# Altium project Arrow-ESC.PrjPcb
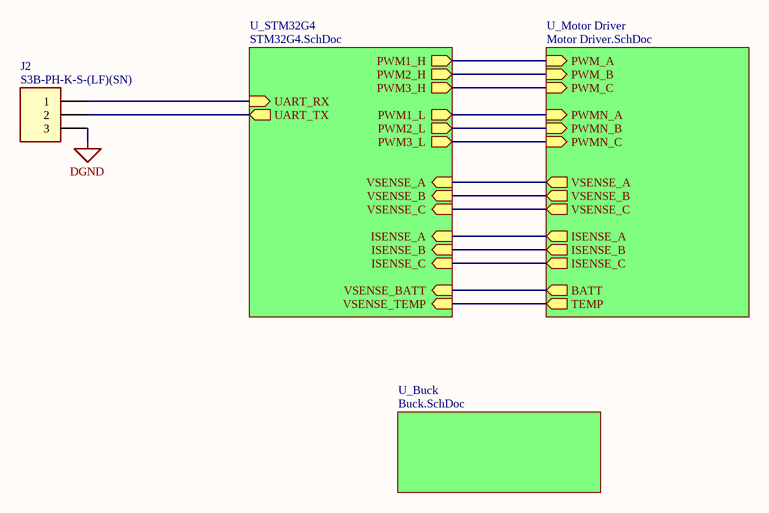
[diagram p0: Top Level.SchDoc]
5 sheets, 87 parts. Net scope: hierarchical (ports join the sheet entries above them; power ports are global).
Board file: Arrow-ESC.PcbDoc
Sheets:
  Top Level.SchDoc
    U_Motor Driver = Motor Driver.SchDoc
      U_Motor Phase = Motor Phase.SchDoc
      U_Motor Phase = Motor Phase.SchDoc
      U_Motor Phase = Motor Phase.SchDoc
    U_STM32G4 = STM32G4.SchDoc
    U_Buck = Buck.SchDoc

## Sheet Top Level.SchDoc
size A; SheetNumber: 1; SheetTotal: 5

### Parts
J2  S3B-PH-K-S-(LF)(SN)  [CONN-TH_3P-P2.00_S3B-PH-K-S-LF-SN]

### Sub-sheets
U_Buck = Buck.SchDoc: no entries
U_Motor Driver = Motor Driver.SchDoc: ISENSE_A (out), ISENSE_B (out), ISENSE_C (out), VSENSE_A (out), VSENSE_B (out), VSENSE_C (out), PWM_A (in), PWM_B (in), PWM_C (in), PWMN_A (in), PWMN_B (in), PWMN_C (in), BATT (out), TEMP (out)
U_STM32G4 = STM32G4.SchDoc: PWM1_H (out), PWM1_L (out), PWM2_H (out), PWM2_L (out), PWM3_H (out), PWM3_L (out), ISENSE_A (in), ISENSE_B (in), ISENSE_C (in), VSENSE_A (in), VSENSE_B (in), VSENSE_C (in), VSENSE_BATT (in), VSENSE_TEMP (in), UART_TX (out), UART_RX (in)

### Nets
DGND: J2.3
ADC1_IN1: sheet U_Motor Driver/VSENSE_A, sheet U_STM32G4/VSENSE_A
ADC1_IN2: sheet U_Motor Driver/VSENSE_B, sheet U_STM32G4/VSENSE_B
ADC1_IN5: sheet U_Motor Driver/VSENSE_C, sheet U_STM32G4/VSENSE_C
ADC1_IN10: sheet U_Motor Driver/BATT, sheet U_STM32G4/VSENSE_BATT
ADC1_IN11: sheet U_Motor Driver/TEMP, sheet U_STM32G4/VSENSE_TEMP
OPAMP1_VINP: sheet U_Motor Driver/ISENSE_A, sheet U_STM32G4/ISENSE_A
OPAMP2_VINP: sheet U_Motor Driver/ISENSE_B, sheet U_STM32G4/ISENSE_B
OPAMP3_VINP: sheet U_Motor Driver/ISENSE_C, sheet U_STM32G4/ISENSE_C
TIM1_CH1: sheet U_Motor Driver/PWM_A, sheet U_STM32G4/PWM1_H
TIM1_CH1N: sheet U_Motor Driver/PWMN_A, sheet U_STM32G4/PWM1_L
TIM1_CH2: sheet U_Motor Driver/PWM_B, sheet U_STM32G4/PWM2_H
TIM1_CH2N: sheet U_Motor Driver/PWMN_B, sheet U_STM32G4/PWM2_L
TIM1_CH3: sheet U_Motor Driver/PWM_C, sheet U_STM32G4/PWM3_H
TIM1_CH3N: sheet U_Motor Driver/PWMN_C, sheet U_STM32G4/PWM3_L
USART3_RX: J2.1 ; sheet U_STM32G4/UART_RX
USART3_TX: J2.2 ; sheet U_STM32G4/UART_TX

### Library data of the parts
J2 = S3B-PH-K-S-(LF)(SN): 3P 1x3P PH Tin -25℃~+85℃ White 2mm 100V 3 2A 1 Right Angle Through Hole,Right Angle,P=2mm Headers, Male Pins RoHS; Manu Part #: S3B-PH-K-S-(LF)(SN); LCSC Part #: C157929

## Sheet Motor Driver.SchDoc
size A; SheetNumber: 3; SheetTotal: 5
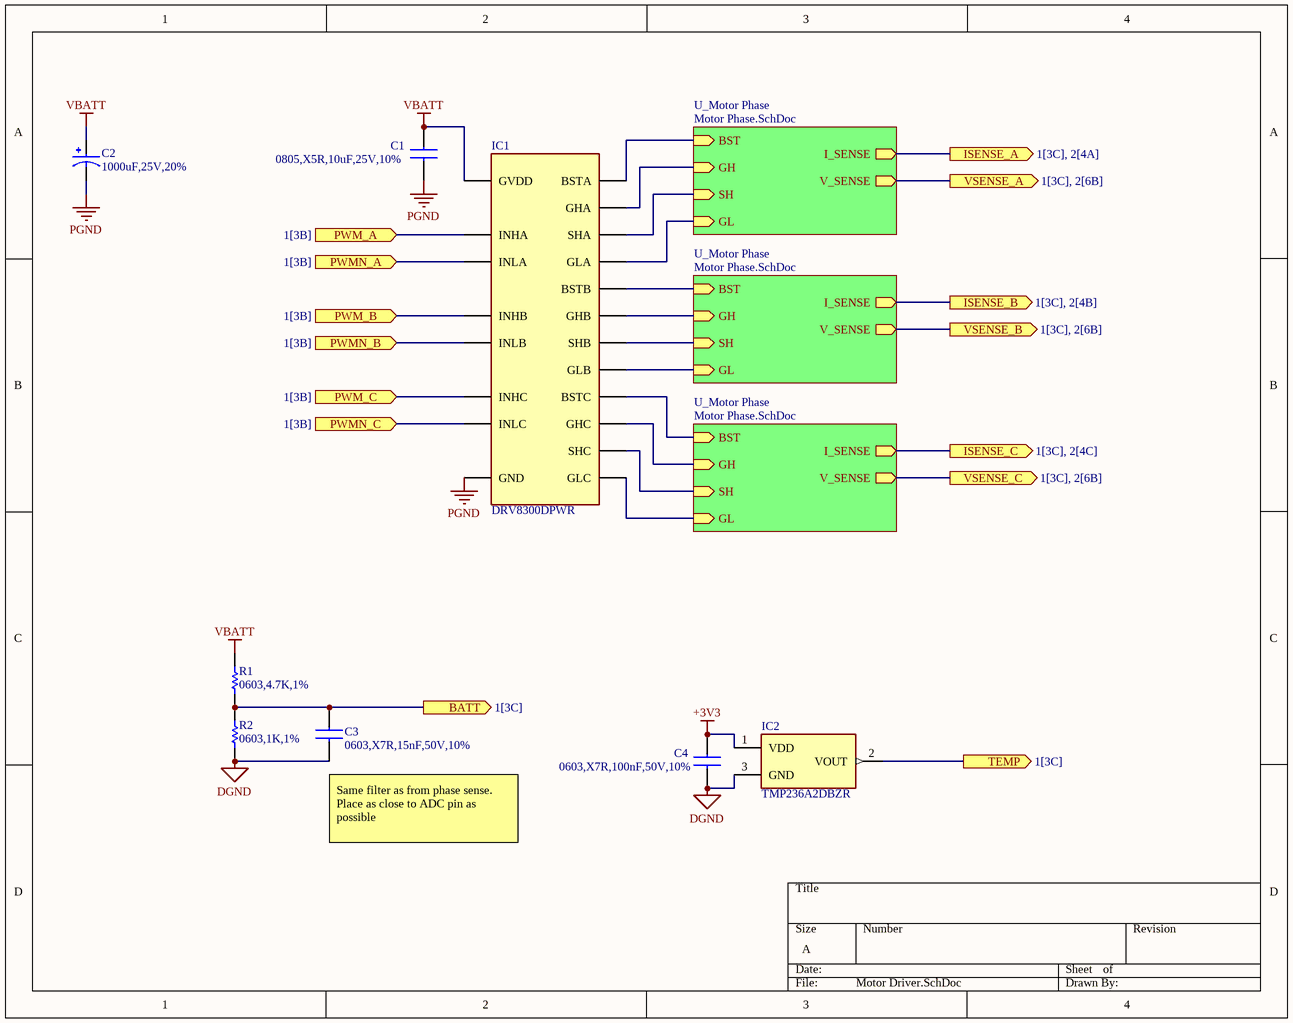
[diagram p1: Motor Driver.SchDoc]

### Parts
C1  0805,X5R,10uF,25V,10%  [CAPC2012X145N]
C2  1000uF,25V,20%  [CAP-TH_BD10.0-P5.00-D1.0-FD]
C3  0603,X7R,15nF,50V,10%  [CAPC1608X90N]
C4  0603,X7R,100nF,50V,10%  [CAPC1608X90N]
IC1  DRV8300DPWR  [SOP65P640X120-20N]
IC2  TMP236A2DBZR  [SOT95P237X112-3N]
R1  0603,4.7K,1%  [RESC1608X55N]
R2  0603,1K,1%  [RESC1608X55N]

### Sub-sheets
U_Motor Phase = Motor Phase.SchDoc: I_SENSE (out), V_SENSE (out), GH (in), BST (in), SH (in), GL (in)
U_Motor Phase = Motor Phase.SchDoc: I_SENSE (out), V_SENSE (out), GH (in), BST (in), SH (in), GL (in)
U_Motor Phase = Motor Phase.SchDoc: I_SENSE (out), V_SENSE (out), GH (in), BST (in), SH (in), GL (in)

### Ports
BATT (out, see 1[3C]), ISENSE_A (out, see 1[3C], 2[4A]), ISENSE_B (out, see 1[3C], 2[4B]), ISENSE_C (out, see 1[3C], 2[4C]), PWM_A (in, see 1[3B]), PWM_B (in, see 1[3B]), PWM_C (in, see 1[3B]), PWMN_A (in, see 1[3B]), PWMN_B (in, see 1[3B]), PWMN_C (in, see 1[3B]), TEMP (out, see 1[3C]), VSENSE_A (out, see 1[3C], 2[6B]), VSENSE_B (out, see 1[3C], 2[6B]), VSENSE_C (out, see 1[3C], 2[6B])

### Nets
+3V3: C4.2 IC2.1(VDD)
DGND: C3.1 C4.1 IC2.3(GND) R2.1
PGND: C1.2 C2.2 IC1.8(GND)
VBATT: C1.1 C2.1 IC1.7(GVDD) R1.2
ADC1_IN1: port VSENSE_A, sheet U_Motor Phase/V_SENSE
ADC1_IN2: port VSENSE_B, sheet U_Motor Phase/V_SENSE
ADC1_IN5: port VSENSE_C, sheet U_Motor Phase/V_SENSE
ADC1_IN10: C3.2 R1.1 R2.2 ; port BATT
ADC1_IN11: IC2.2(VOUT) ; port TEMP
OPAMP1_VINP: port ISENSE_A, sheet U_Motor Phase/I_SENSE
OPAMP2_VINP: port ISENSE_B, sheet U_Motor Phase/I_SENSE
OPAMP3_VINP: port ISENSE_C, sheet U_Motor Phase/I_SENSE
TIM1_CH1: IC1.1(INHA) ; port PWM_A
TIM1_CH1N: IC1.4(INLA) ; port PWMN_A
TIM1_CH2: IC1.2(INHB) ; port PWM_B
TIM1_CH2N: IC1.5(INLB) ; port PWMN_B
TIM1_CH3: IC1.3(INHC) ; port PWM_C
TIM1_CH3N: IC1.6(INLC) ; port PWMN_C
NetC5_1_1: IC1.12(SHC) ; sheet U_Motor Phase/SH
NetC5_1_2: IC1.14(BSTC) ; sheet U_Motor Phase/BST
NetC5_2_1: IC1.15(SHB) ; sheet U_Motor Phase/SH
NetC5_2_2: IC1.17(BSTB) ; sheet U_Motor Phase/BST
NetC5_3_1: IC1.18(SHA) ; sheet U_Motor Phase/SH
NetC5_3_2: IC1.20(BSTA) ; sheet U_Motor Phase/BST
NetIC1_9: IC1.9(GLC) ; sheet U_Motor Phase/GL
NetIC1_10: IC1.10(GLB) ; sheet U_Motor Phase/GL
NetIC1_11: IC1.11(GLA) ; sheet U_Motor Phase/GL
NetIC1_13: IC1.13(GHC) ; sheet U_Motor Phase/GH
NetIC1_16: IC1.16(GHB) ; sheet U_Motor Phase/GH
NetIC1_19: IC1.19(GHA) ; sheet U_Motor Phase/GH

### Notes on the sheet
- (near C3) Same filter as from phase sense.
  Place as close to ADC pin as possible

### Library data of the parts
C1 = CC0805KKX5R8BB106: 10 µF ±10% 25V Ceramic Capacitor X5R 0805 (2012 Metric); Manufacturer_Name: YAGEO; Datasheet Link: https://www.yageo.com/upload/media/product/productsearch/datasheet/mlcc/UPY-GPHC_X5R_4V-to-50V_27.pdf; Height: 1.45mm; Manufacturer_Part_Number: CC0805KKX5R8BB106; Mouser Part Number: 603-CC805KKX5R8BB106; Mouser Price/Stock: https://www.mouser.co.uk/ProductDetail/YAGEO/CC0805KKX5R8BB106?qs=57cj7OiSijm89pM64t1AGQ%3D%3D; Arrow Part Number: CC0805KKX5R8BB106; Arrow Price/Stock: https://www.arrow.com/en/products/cc0805kkx5r8bb106/yageo?utm_currency=USD&region=nac; LCSC Part #: C89831
C2 = 25PK1000MEFC10*16: 1000uF 25V ±20% 870mA@120Hz Through Hole,D10xL16mm Aluminum Electrolytic Capacitors - Leaded ROHS; LCSC Part #: C109451
C3 = CC0603KRX7R9BB153: 50V 15nF X7R ±10% 0603 Multilayer Ceramic Capacitors MLCC - SMD/SMT ROHS; Manufacturer_Name: YAGEO; Datasheet Link: https://componentsearchengine.com/Datasheets/2/CC0603KRX7R9BB104.pdf; Height: 0.9mm; Manufacturer_Part_Number: CC0603KRX7R9BB153; Mouser Part Number: 603-CC603KRX7R9BB104; Mouser Price/Stock: https://www.mouser.co.uk/ProductDetail/YAGEO/CC0603KRX7R9BB104?qs=vTakOoo5QyLvVCYM2ge8LQ%3D%3D; Arrow Part Number: CC0603KRX7R9BB104; Arrow Price/Stock: https://www.arrow.com/en/products/cc0603krx7r9bb104/yageo?utm_currency=USD&region=europe; LCSC Part #: C107076
C4 = CC0603KRX7R9BB104: 50V 100nF X7R ±10% 0603 Multilayer Ceramic Capacitors MLCC - SMD/SMT ROHS; Manufacturer_Name: YAGEO; Datasheet Link: https://componentsearchengine.com/Datasheets/2/CC0603KRX7R9BB104.pdf; Height: 0.9mm; Manufacturer_Part_Number: CC0603KRX7R9BB104; Mouser Part Number: 603-CC603KRX7R9BB104; Mouser Price/Stock: https://www.mouser.co.uk/ProductDetail/YAGEO/CC0603KRX7R9BB104?qs=vTakOoo5QyLvVCYM2ge8LQ%3D%3D; Arrow Part Number: CC0603KRX7R9BB104; Arrow Price/Stock: https://www.arrow.com/en/products/cc0603krx7r9bb104/yageo?utm_currency=USD&region=europe; LCSC Part #: C14663
IC1 = DRV8300DPWR: TSSOP-20 Brushless DC (BLDC) Motor Driver ROHS; Manufacturer_Name: Texas Instruments; Height: 1.2mm; Manufacturer_Part_Number: DRV8300DPWR; Mouser Part Number: 595-DRV8300DPWR; Mouser Price/Stock: https://www.mouser.co.uk/ProductDetail/Texas-Instruments/DRV8300DPWR?qs=eP2BKZSCXI6qJbKdYnGwBg%3D%3D; Arrow Part Number: DRV8300DPWR; Arrow Price/Stock: https://www.arrow.com/en/products/drv8300dpwr/texas-instruments?utm_currency=USD&region=nac; LCSC Part #: C3036056
IC2 = TMP236A2DBZR: Low-power and high-precision analog output temperature sensor; Manufacturer_Name: Texas Instruments; Datasheet Link: http://www.ti.com/lit/gpn/tmp236; Height: 1.12mm; Manufacturer_Part_Number: TMP236A2DBZR; Mouser Part Number: 595-TMP236A2DBZR; Mouser Price/Stock: https://www.mouser.co.uk/ProductDetail/Texas-Instruments/TMP236A2DBZR?qs=lc2O%252BfHJPVanftlPgPUvow%3D%3D; Arrow Part Number: TMP236A2DBZR; Arrow Price/Stock: https://www.arrow.com/en/products/tmp236a2dbzr/texas-instruments?region=nac; LCSC Part #: C2859666
R1 = RC0603FR-074K7L: 100mW Thick Film Resistor 75V ±100ppm/℃ ±1% 4.7kΩ 0603 Chip Resistor - Surface Mount ROHS; Manufacturer_Name: YAGEO; Datasheet Link: https://www.mouser.com/catalog/specsheets/YAGEO_PYu_RC_Group_51_RoHS_L_12.pdf; Height: 0.55mm; Manufacturer_Part_Number: RC0603FR-074K7L; LCSC Part #: C99782
R2 = RC0603FR-071KL: 100mW Thick Film Resistor 75V ±100ppm/℃ ±1% 1kΩ 0603 Chip Resistor - Surface Mount ROHS; Manufacturer_Name: YAGEO; Datasheet Link: https://www.mouser.com/catalog/specsheets/YAGEO_PYu_RC_Group_51_RoHS_L_12.pdf; Height: 0.55mm; Manufacturer_Part_Number: RC0603FR-071KL; LCSC Part #: C22548

## Sheet Motor Phase.SchDoc
size A; SheetNumber: 4; SheetTotal: 5
Used 3 times, as channels U_Motor Driver/U_Motor Phase, U_Motor Driver/U_Motor Phase, U_Motor Driver/U_Motor Phase. Parts and nets are listed once, with the designators drawn on the sheet.
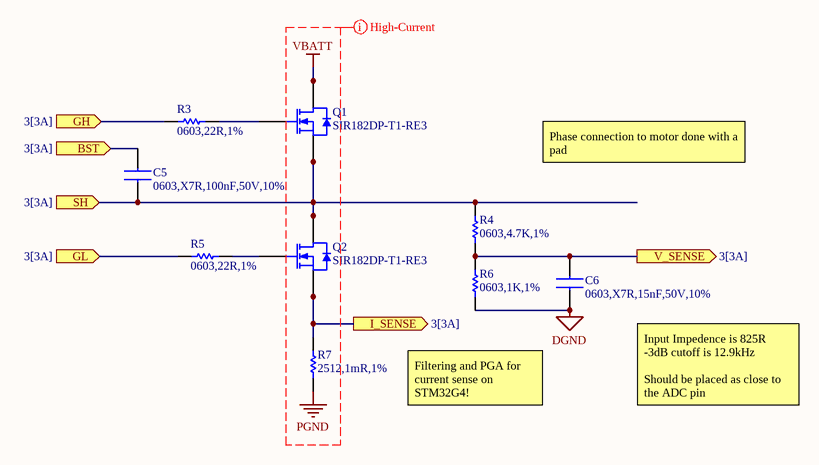
[diagram p2: Motor Phase.SchDoc]

### Parts
C5  0603,X7R,100nF,50V,10%  [CAPC1608X90N]
C6  0603,X7R,15nF,50V,10%  [CAPC1608X90N]
Q1  SIR182DP-T1-RE3  [POWERPAK-SO-8_L5.9-W4.9-P1.27-LS6.2-BL]
Q2  SIR182DP-T1-RE3  [POWERPAK-SO-8_L5.9-W4.9-P1.27-LS6.2-BL]
R3  0603,22R,1%  [RESC1608X55N]
R4  0603,4.7K,1%  [RESC1608X55N]
R5  0603,22R,1%  [RESC1608X55N]
R6  0603,1K,1%  [RESC1608X55N]
R7  2512,1mR,1%  [RES-SMD_L6.4-W3.2_RLP25]

### Ports
BST (in, see 3[3A]), GH (in, see 3[3A]), GL (in, see 3[3A]), I_SENSE (out, see 3[3A]), SH (in, see 3[3A]), V_SENSE (out, see 3[3A])

### Nets
DGND: C6.1 R6.1
PGND: R7.1
VBATT: Q1.5(D) Q1.6(D) Q1.7(D) Q1.8(D)
BST: C5.2 ; port BST
GH: R3.1 ; port GH
GL: R5.1 ; port GL
I_SENSE: Q2.1(S) Q2.2(S) Q2.3(S) R7.2 ; port I_SENSE
SH: C5.1 Q1.1(S) Q1.2(S) Q1.3(S) Q2.5(D) Q2.6(D) Q2.7(D) Q2.8(D) R4.2 ; port SH
V_SENSE: C6.2 R4.1 R6.2 ; port V_SENSE
NetQ1_4: Q1.4(G) R3.2
NetQ2_4: Q2.4(G) R5.2

### Channels
U_Motor Driver/U_Motor Phase: designators end in _3; ports BST=NetC5_3_2 GH=NetIC1_19 GL=NetIC1_11 I_SENSE=OPAMP1_VINP SH=NetC5_3_1 V_SENSE=ADC1_IN1
U_Motor Driver/U_Motor Phase: designators end in _2; ports BST=NetC5_2_2 GH=NetIC1_16 GL=NetIC1_10 I_SENSE=OPAMP2_VINP SH=NetC5_2_1 V_SENSE=ADC1_IN2
U_Motor Driver/U_Motor Phase: designators end in _1; ports BST=NetC5_1_2 GH=NetIC1_13 GL=NetIC1_9 I_SENSE=OPAMP3_VINP SH=NetC5_1_1 V_SENSE=ADC1_IN5

### Layout directives
net class High-Current: PGND, VBATT

### Notes on the sheet
- Phase connection to motor done with a pad
- Filtering and PGA for current sense on STM32G4!
- Input Impedence is 825R
  -3dB cutoff is 12.9kHz
  Should be placed as close to the ADC pin

### Library data of the parts
C5 = CC0603KRX7R9BB104: as C4 on sheet Motor Driver; Datasheet Link: https://componentsearchengine.com/Datasheets/2/CC0603KRX7R9BB104.pdf; Height: 0.9mm; Manufacturer_Part_Number: CC0603KRX7R9BB104; Mouser Part Number: 603-CC603KRX7R9BB104; Mouser Price/Stock: https://www.mouser.co.uk/ProductDetail/YAGEO/CC0603KRX7R9BB104?qs=vTakOoo5QyLvVCYM2ge8LQ%3D%3D; Arrow Part Number: CC0603KRX7R9BB104; Arrow Price/Stock: https://www.arrow.com/en/products/cc0603krx7r9bb104/yageo?utm_currency=USD&region=europe; LCSC Part #: C14663
C6 = CC0603KRX7R9BB153: as C3 on sheet Motor Driver; Datasheet Link: https://componentsearchengine.com/Datasheets/2/CC0603KRX7R9BB104.pdf; Height: 0.9mm; Manufacturer_Part_Number: CC0603KRX7R9BB153; Mouser Part Number: 603-CC603KRX7R9BB104; Mouser Price/Stock: https://www.mouser.co.uk/ProductDetail/YAGEO/CC0603KRX7R9BB104?qs=vTakOoo5QyLvVCYM2ge8LQ%3D%3D; Arrow Part Number: CC0603KRX7R9BB104; Arrow Price/Stock: https://www.arrow.com/en/products/cc0603krx7r9bb104/yageo?utm_currency=USD&region=europe; LCSC Part #: C107076
Q1 Q2 = SIR182DP-T1-RE3: 60V 117A 2.8mΩ@10V,15A 2V 1 N-Channel PowerPAKSO-8 MOSFETs ROHS; LCSC Part #: C467943
R3 R5 = RC0603FR-0722RL: 100mW Thick Film Resistor 75V ±100ppm/℃ ±1% 22Ω 0603 Chip Resistor - Surface Mount ROHS; Manufacturer_Name: YAGEO; Datasheet Link: http://www.farnell.com/datasheets/1868787.pdf; Height: 0.55mm; Manufacturer_Part_Number: RC0603FR-0722RL; Mouser Part Number: 603-RC0603FR-0722RL; Mouser Price/Stock: https://www.mouser.co.uk/ProductDetail/YAGEO/RC0603FR-0722RL?qs=diQw95jMAeMOsxb8bne7fg%3D%3D; Arrow Part Number: RC0603FR-0722RL; Arrow Price/Stock: https://www.arrow.com/en/products/rc0603fr-0722rl/yageo?region=nac; LCSC Part #: C107701
R4 = RC0603FR-074K7L: as R1 on sheet Motor Driver; Datasheet Link: https://www.mouser.com/catalog/specsheets/YAGEO_PYu_RC_Group_51_RoHS_L_12.pdf; Height: 0.55mm; Manufacturer_Part_Number: RC0603FR-074K7L; LCSC Part #: C99782
R6 = RC0603FR-071KL: as R2 on sheet Motor Driver; Datasheet Link: https://www.mouser.com/catalog/specsheets/YAGEO_PYu_RC_Group_51_RoHS_L_12.pdf; Height: 0.55mm; Manufacturer_Part_Number: RC0603FR-071KL; LCSC Part #: C22548
R7 = PA2512FKF7T0R001E: 3W 1mΩ Surface Mount Current Sense Resistor ±100ppm/℃ ±1% 2512 Current Sense Resistors / Shunt Resistors ROHS; LCSC Part #: C723380

## Sheet STM32G4.SchDoc
size B; SheetNumber: 2; SheetTotal: 5
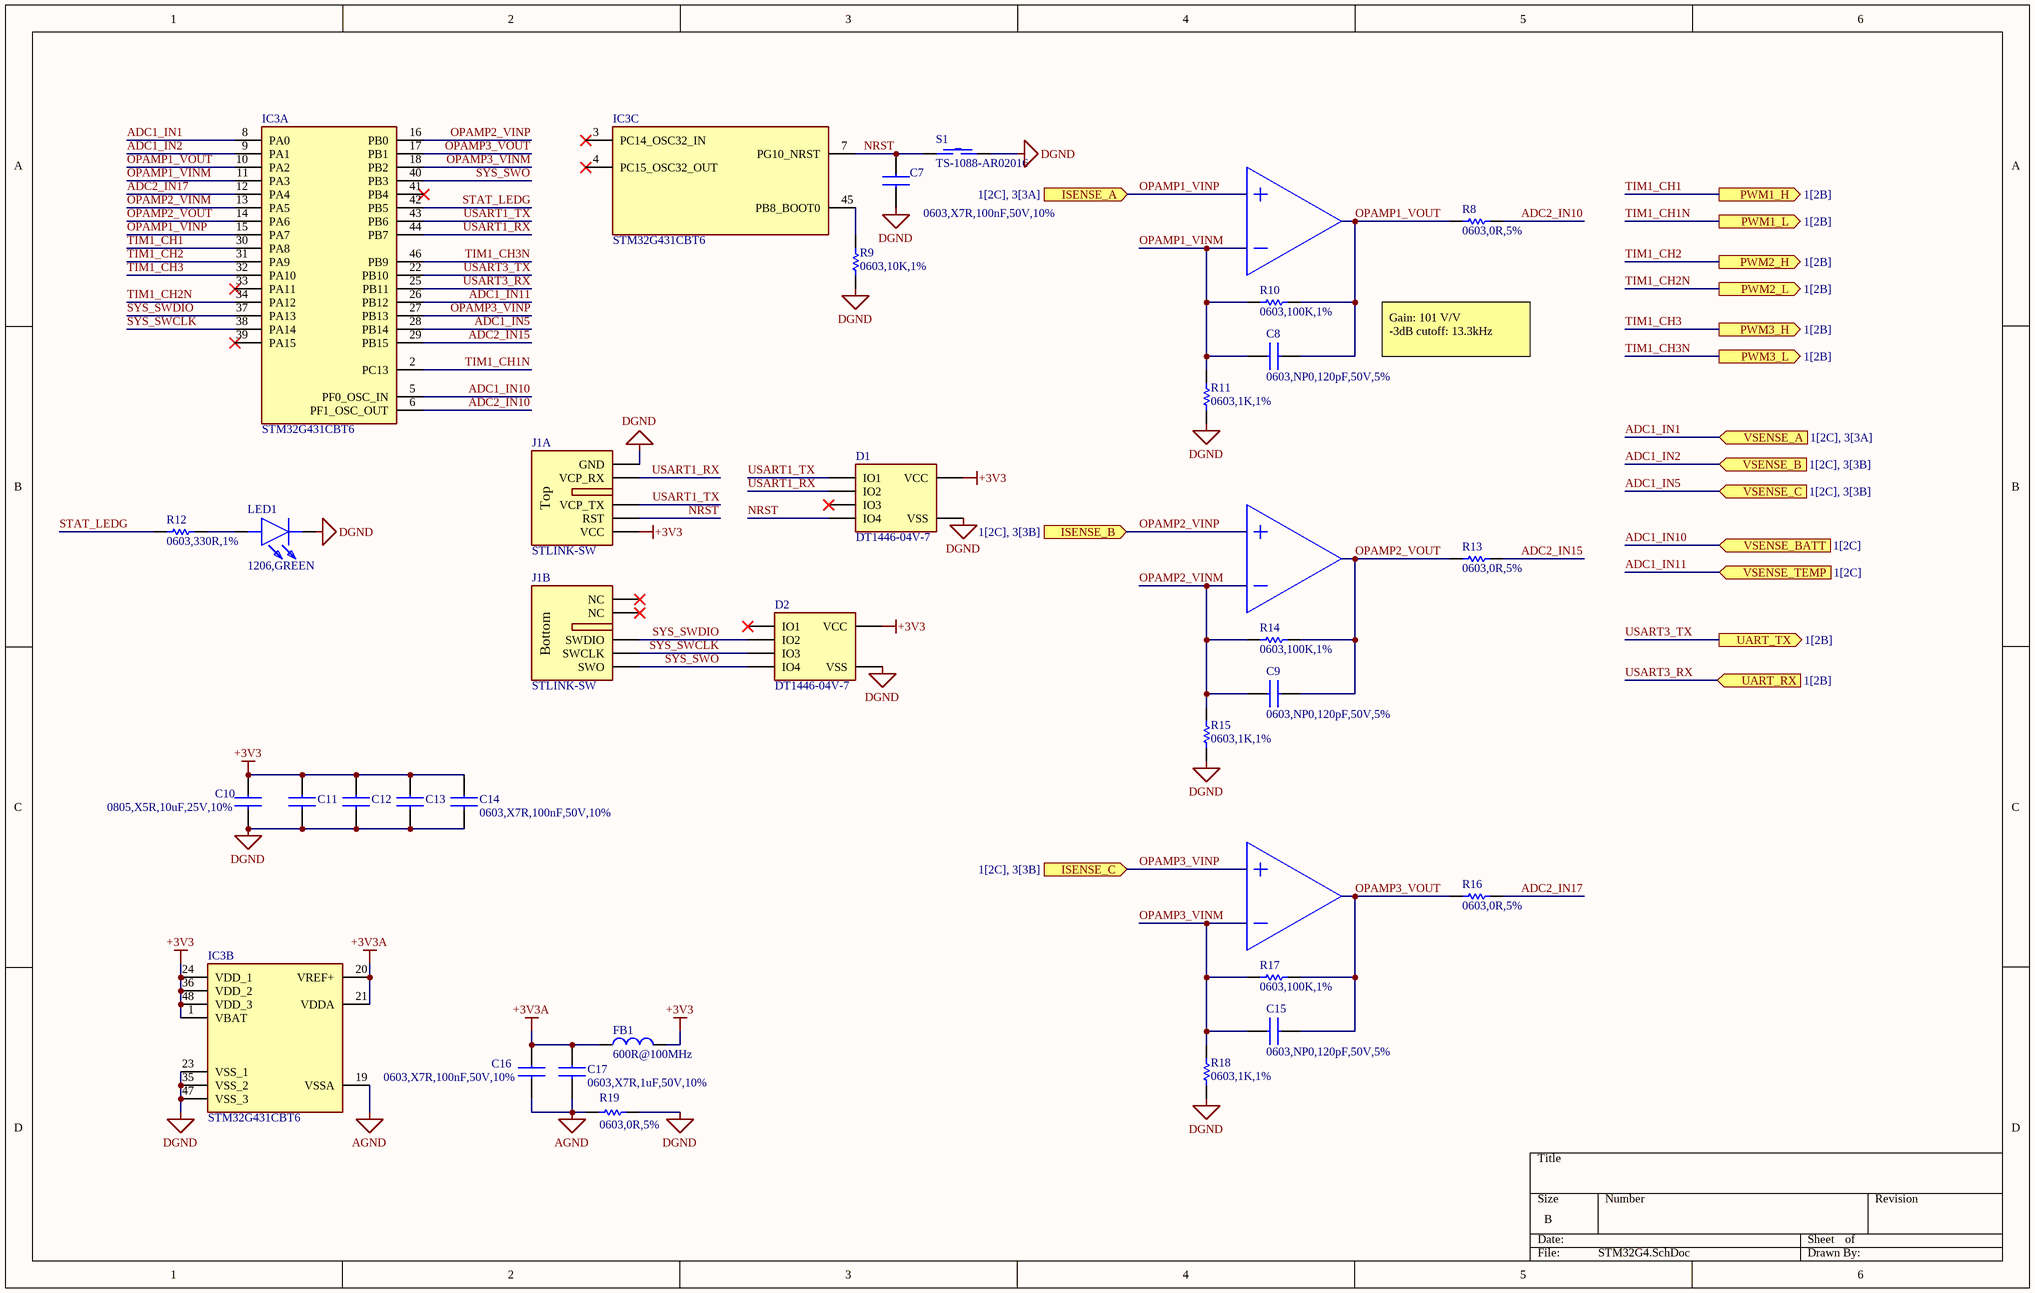
[diagram p3: STM32G4.SchDoc]

### Parts
C7  0603,X7R,100nF,50V,10%  [CAPC1608X90N]
C8  0603,NP0,120pF,50V,5%  [CAPC1608X90N]
C9  0603,NP0,120pF,50V,5%  [CAPC1608X90N]
C10  0805,X5R,10uF,25V,10%  [CAPC2012X145N]
C11  0603,X7R,100nF,50V,10%  [CAPC1608X90N]  (value not drawn)
C12  0603,X7R,100nF,50V,10%  [CAPC1608X90N]  (value not drawn)
C13  0603,X7R,100nF,50V,10%  [CAPC1608X90N]  (value not drawn)
C14  0603,X7R,100nF,50V,10%  [CAPC1608X90N]
C15  0603,NP0,120pF,50V,5%  [CAPC1608X90N]
C16  0603,X7R,100nF,50V,10%  [CAPC1608X90N]
C17  0603,X7R,1uF,50V,10%  [CAPC1608X90N]
D1  DT1446-04V-7  [SOTFL50P162X60-6N]
D2  DT1446-04V-7  [SOTFL50P162X60-6N]
FB1  600R@100MHz  [L0603]
IC3  STM32G431CBT6  [QFP50P900X900X160-48N]  (parts A,B,C of 3)
J1  STLINK-SW  [009159010061911]  (parts A,B of 2)  (no BOM)
LED1  1206,GREEN  [LEDC3216X120N]
R8  0603,0R,5%  [RESC1608X55N]
R9  0603,10K,1%  [RESC1608X55N]
R10  0603,100K,1%  [RESC1608X55N]
R11  0603,1K,1%  [RESC1608X55N]
R12  0603,330R,1%  [RESC1608X55N]
R13  0603,0R,5%  [RESC1608X55N]
R14  0603,100K,1%  [RESC1608X55N]
R15  0603,1K,1%  [RESC1608X55N]
R16  0603,0R,5%  [RESC1608X55N]
R17  0603,100K,1%  [RESC1608X55N]
R18  0603,1K,1%  [RESC1608X55N]
R19  0603,0R,5%  [RESC1608X55N]
S1  TS-1088-AR02016  [SW-SMD_L3.9-W3.0-P4.45]

### Ports
ISENSE_A (in, see 1[2C], 3[3A]), ISENSE_B (in, see 1[2C], 3[3B]), ISENSE_C (in, see 1[2C], 3[3B]), PWM1_H (out, see 1[2B]), PWM1_L (out, see 1[2B]), PWM2_H (out, see 1[2B]), PWM2_L (out, see 1[2B]), PWM3_H (out, see 1[2B]), PWM3_L (out, see 1[2B]), UART_RX (in, see 1[2B]), UART_TX (out, see 1[2B]), VSENSE_A (in, see 1[2C], 3[3A]), VSENSE_B (in, see 1[2C], 3[3B]), VSENSE_BATT (in, see 1[2C]), VSENSE_C (in, see 1[2C], 3[3B]), VSENSE_TEMP (in, see 1[2C])

### Nets
+3V3: C10.2 C11.2 C12.2 C13.2 C14.2 D1.5(VCC) D2.5(VCC) FB1.2 IC3.1(VBAT) IC3.24(VDD_1) IC3.36(VDD_2) IC3.48(VDD_3) J1.5(VCC)
+3V3A: C16.2 C17.2 FB1.1 IC3.20(VREF+) IC3.21(VDDA)
AGND: C16.1 C17.1 IC3.19(VSSA) R19.1
DGND: C7.1 C10.1 C11.1 C12.1 C13.1 C14.1 D1.2(VSS) D2.2(VSS) IC3.23(VSS_1) IC3.35(VSS_2) IC3.47(VSS_3) J1.1(GND) LED1.1(K) R9.1 R11.1 R15.1 R18.1 R19.2 S1.1
ADC1_IN1: IC3.8(PA0) ; port VSENSE_A
ADC1_IN2: IC3.9(PA1) ; port VSENSE_B
ADC1_IN5: IC3.28(PB14) ; port VSENSE_C
ADC1_IN10: IC3.5(PF0_OSC_IN) ; port VSENSE_BATT
ADC1_IN11: IC3.26(PB12) ; port VSENSE_TEMP
ADC2_IN10: IC3.6(PF1_OSC_OUT) R8.2
ADC2_IN15: IC3.29(PB15) R13.2
ADC2_IN17: IC3.12(PA4) R16.2
NRST: C7.2 D1.6(IO4) IC3.7(PG10_NRST) J1.4(RST) S1.2
OPAMP1_VINM: C8.1 IC3.11(PA3) R10.1 R11.2
OPAMP1_VINP: IC3.15(PA7) ; port ISENSE_A
OPAMP1_VOUT: C8.2 IC3.10(PA2) R8.1 R10.2
OPAMP2_VINM: C9.1 IC3.13(PA5) R14.1 R15.2
OPAMP2_VINP: IC3.16(PB0) ; port ISENSE_B
OPAMP2_VOUT: C9.2 IC3.14(PA6) R13.1 R14.2
OPAMP3_VINM: C15.1 IC3.18(PB2) R17.1 R18.2
OPAMP3_VINP: IC3.27(PB13) ; port ISENSE_C
OPAMP3_VOUT: C15.2 IC3.17(PB1) R16.1 R17.2
STAT_LEDG: IC3.42(PB5) R12.1
SYS_SWCLK: D2.4(IO3) IC3.38(PA14) J1.9(SWCLK)
SYS_SWDIO: D2.3(IO2) IC3.37(PA13) J1.8(SWDIO)
SYS_SWO: D2.6(IO4) IC3.40(PB3) J1.10(SWO)
TIM1_CH1: IC3.30(PA8) ; port PWM1_H
TIM1_CH1N: IC3.2(PC13) ; port PWM1_L
TIM1_CH2: IC3.31(PA9) ; port PWM2_H
TIM1_CH2N: IC3.34(PA12) ; port PWM2_L
TIM1_CH3: IC3.32(PA10) ; port PWM3_H
TIM1_CH3N: IC3.46(PB9) ; port PWM3_L
USART1_RX: D1.3(IO2) IC3.44(PB7) J1.2(VCP_RX)
USART1_TX: D1.1(IO1) IC3.43(PB6) J1.3(VCP_TX)
USART3_RX: IC3.25(PB11) ; port UART_RX
USART3_TX: IC3.22(PB10) ; port UART_TX
NetIC3_45: IC3.45(PB8_BOOT0) R9.2
NetLED1_2: LED1.2(A) R12.2

Not connected (* = marked no-connect by the designer): D1 4(IO3)*; D2 1(IO1)*; IC3 3(PC14_OSC32_IN)* 4(PC15_OSC32_OUT)* 33(PA11)* 39(PA15)* 41(PB4)*; J1 6(NC)* 7(NC)*

### Notes on the sheet
- Gain: 101 V/V
  -3dB cutoff: 13.3kHz
- (in symbol STLINK-SW, part A) Top
- (in symbol STLINK-SW, part B) Bottom

### Library data of the parts
C7 C11-C14 C16 = CC0603KRX7R9BB104: as C4 on sheet Motor Driver; Datasheet Link: https://componentsearchengine.com/Datasheets/2/CC0603KRX7R9BB104.pdf; Height: 0.9mm; Manufacturer_Part_Number: CC0603KRX7R9BB104; Mouser Part Number: 603-CC603KRX7R9BB104; Mouser Price/Stock: https://www.mouser.co.uk/ProductDetail/YAGEO/CC0603KRX7R9BB104?qs=vTakOoo5QyLvVCYM2ge8LQ%3D%3D; Arrow Part Number: CC0603KRX7R9BB104; Arrow Price/Stock: https://www.arrow.com/en/products/cc0603krx7r9bb104/yageo?utm_currency=USD&region=europe; LCSC Part #: C14663
C8 C9 C15 = CC0603JRNPO9BN121: 50V 120pF NP0 ±5% 0603 Multilayer Ceramic Capacitors MLCC - SMD/SMT ROHS; Manufacturer_Name: YAGEO; Datasheet Link: https://componentsearchengine.com/Datasheets/2/CC0603KRX7R9BB104.pdf; Height: 0.9mm; Manufacturer_Part_Number: CC0603JRNPO9BN121; Mouser Part Number: 603-CC603KRX7R9BB104; Mouser Price/Stock: https://www.mouser.co.uk/ProductDetail/YAGEO/CC0603KRX7R9BB104?qs=vTakOoo5QyLvVCYM2ge8LQ%3D%3D; Arrow Part Number: CC0603KRX7R9BB104; Arrow Price/Stock: https://www.arrow.com/en/products/cc0603krx7r9bb104/yageo?utm_currency=USD&region=europe; LCSC Part #: C107035
C10 = CC0805KKX5R8BB106: as C1 on sheet Motor Driver; Datasheet Link: https://www.yageo.com/upload/media/product/productsearch/datasheet/mlcc/UPY-GPHC_X5R_4V-to-50V_27.pdf; Height: 1.45mm; Manufacturer_Part_Number: CC0805KKX5R8BB106; Mouser Part Number: 603-CC805KKX5R8BB106; Mouser Price/Stock: https://www.mouser.co.uk/ProductDetail/YAGEO/CC0805KKX5R8BB106?qs=57cj7OiSijm89pM64t1AGQ%3D%3D; Arrow Part Number: CC0805KKX5R8BB106; Arrow Price/Stock: https://www.arrow.com/en/products/cc0805kkx5r8bb106/yageo?utm_currency=USD&region=nac; LCSC Part #: C89831
C17 = CC0603KRX7R9BB105: 50V 1uF X7R ±10% 0603 Multilayer Ceramic Capacitors MLCC - SMD/SMT ROHS; Manufacturer_Name: YAGEO; Datasheet Link: https://www.yageo.com/upload/media/product/app/datasheet/mlcc/upy-gphc_x7r_6_3v-to-250v.pdf; Height: 0.95mm; Manufacturer_Part_Number: CC0603KRX7R9BB105; Mouser Part Number: 603-CC603KRX7R9BB105; Mouser Price/Stock: https://www.mouser.co.uk/ProductDetail/YAGEO/CC0603KRX7R9BB105?qs=6wERJjOp3mmF17%252BYi8cgJQ%3D%3D; Arrow Part Number: CC0603KRX7R9BB105; Arrow Price/Stock: https://www.arrow.com/en/products/cc0603krx7r9bb105/yageo?utm_currency=USD&region=nac; LCSC Part #: C559769
D1 D2 = DT1446-04V-7: 8.5V Clamp 4.7A (8/20µs) Ipp Tvs Diode Surface Mount SOT-563; Manufacturer_Name: Diodes Incorporated; Datasheet Link: https://www.diodes.com//assets/Datasheets/DT1446-04V.pdf; Height: 0.6mm; Manufacturer_Part_Number: DT1446-04V-7; Mouser Part Number: 621-DT1446-04V-7; Mouser Price/Stock: https://www.mouser.co.uk/ProductDetail/Diodes-Incorporated/DT1446-04V-7?qs=5V6w%252Be2aIqaQkUd2yRdmdA%3D%3D; Arrow Part Number: DT1446-04V-7; Arrow Price/Stock: https://www.arrow.com/en/products/dt1446-04v-7/diodes-incorporated; Manu Part #: DT1446-04V-7; LCSC Part #: C460066
FB1 = BLM18AG601SN1D: 380mΩ ±25% 600Ω@100MHz 0603 Ferrite Beads ROHS; LCSC Part #: C19330
IC3 = STM32G431CBT6: Arm Cortex-M4 32-bit MCU+FPU, 170 MHz / 213 DMIPS, up to 128 KB Flash, 32 KB SRAM, rich analog, math accelerator; Manufacturer_Name: STMicroelectronics; Datasheet Link: https://www.st.com/resource/en/datasheet/stm32g431cb.pdf; Height: 1.6mm; Manufacturer_Part_Number: STM32G431CBT6; Mouser Part Number: 511-STM32G431CBT6; Mouser Price/Stock: https://www.mouser.co.uk/ProductDetail/STMicroelectronics/STM32G431CBT6?qs=T3oQrply3y8OocyGDXq5wg%3D%3D; Arrow Part Number: STM32G431CBT6; Arrow Price/Stock: https://www.arrow.com/en/products/stm32g431cbt6/stmicroelectronics?utm_currency=USD&region=nac; LCSC Part #: C529355
J1 = STLINK-SW: SSL Connector 10 Position Adapter, Bridge Board to Board - Card Edge 0.079" (2.00mm)
LED1 = LTST-C150KGKT: 20mA 44.5mcd Water Clear -55℃~+85℃ 571nm Yellow Green 130° 75mW 2V 1206 LED Indication - Discrete ROHS; Manufacturer_Name: Lite-On; Datasheet Link: http://optoelectronics.liteon.com/upload/download/ds22-2000-072/ltst-c150kgkt.pdf; Height: 1.2mm; Manufacturer_Part_Number: LTST-C150KGKT; Mouser Part Number: 859-LTST-C150KGKT; Mouser Price/Stock: https://www.mouser.co.uk/ProductDetail/Lite-On/LTST-C150KGKT?qs=G7lFeYdtIHB%2FzaFKBwEyXw%3D%3D; Arrow Part Number: LTST-C150KGKT; Arrow Price/Stock: https://www.arrow.com/en/products/ltst-c150kgkt/lite-on-technology?utm_currency=USD&region=nac; LCSC Part #: C125085; Manu Part #: LTST-C150KGKT
R8 R13 R16 R19 = RC0603JR-070RL: 100mW Thick Film Resistor 75V ±5% 0Ω 0603 Chip Resistor - Surface Mount ROHS; Manufacturer_Name: YAGEO; Datasheet Link: https://www.mouser.com/catalog/specsheets/YAGEO_PYu_RC_Group_51_RoHS_L_12.pdf; Height: 0.55mm; Manufacturer_Part_Number: RC0603JR-070RL; LCSC Part #: C95177
R9 = RC0603FR-0710KL: 100mW 10kΩ 75V ±100ppm/℃ Thick Film Resistor ±1% 0603 Chip Resistor - Surface Mount RoHS; Manufacturer_Name: YAGEO; Datasheet Link: https://www.mouser.com/catalog/specsheets/YAGEO_PYu_RC_Group_51_RoHS_L_12.pdf; Height: 0.55mm; Manufacturer_Part_Number: RC0603FR-0710KL; LCSC Part #: C98220
R10 R14 R17 = RC0603FR-07100KL: 100mW Thick Film Resistor 75V ±100ppm/℃ ±1% 100kΩ 0603 Chip Resistor - Surface Mount ROHS; Manufacturer_Name: YAGEO; Datasheet Link: https://www.mouser.com/catalog/specsheets/YAGEO_PYu_RC_Group_51_RoHS_L_12.pdf; Height: 0.55mm; Manufacturer_Part_Number: RC0603FR-07100KL; LCSC Part #: C14675
R11 R15 R18 = RC0603FR-071KL: as R2 on sheet Motor Driver; Datasheet Link: https://www.mouser.com/catalog/specsheets/YAGEO_PYu_RC_Group_51_RoHS_L_12.pdf; Height: 0.55mm; Manufacturer_Part_Number: RC0603FR-071KL; LCSC Part #: C22548
R12 = RC0603FR-07330RL: 100mW 330Ω 75V ±100ppm/℃ Thick Film Resistor ±1% 0603 Chip Resistor - Surface Mount RoHS; Manufacturer_Name: YAGEO; Datasheet Link: https://www.mouser.com/catalog/specsheets/YAGEO_PYu_RC_Group_51_RoHS_L_12.pdf; Height: 0.55mm; Manufacturer_Part_Number: RC0603FR-07330RL; LCSC Part #: C105881; Manu Part #: RC0603FR-07330RL
S1 = TS-1088-AR02016: Without Bracket 50mA 4mm 100,000 Cycles 12V 1.6N 3mm 2mm Round Button Surface Mount,Vertical SPST SMD Tactile Switches ROHS; LCSC Part #: C720477; Manu Part #: TS-1088-AR02016

## Sheet Buck.SchDoc
size A; SheetNumber: 5; SheetTotal: 5
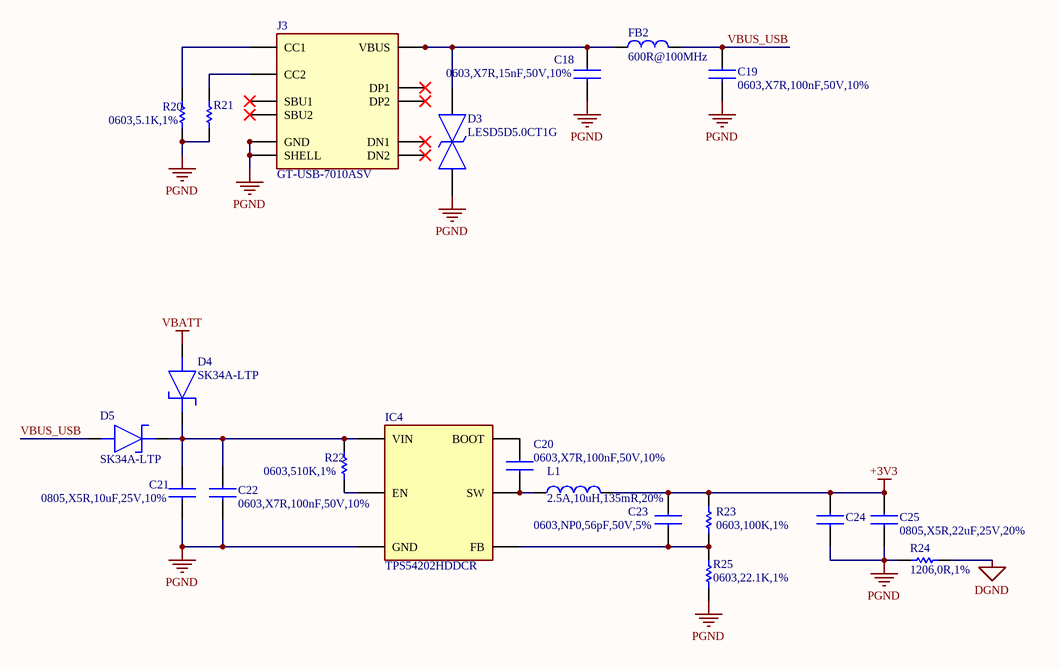
[diagram p4: Buck.SchDoc]

### Parts
C18  0603,X7R,15nF,50V,10%  [CAPC1608X90N]
C19  0603,X7R,100nF,50V,10%  [CAPC1608X90N]
C20  0603,X7R,100nF,50V,10%  [CAPC1608X90N]
C21  0805,X5R,10uF,25V,10%  [CAPC2012X145N]
C22  0603,X7R,100nF,50V,10%  [CAPC1608X90N]
C23  0603,NP0,56pF,50V,5%  [CAPC1608X90N]
C24  0805,X5R,22uF,25V,20%  [CAPC2012X145N]  (value not drawn)
C25  0805,X5R,22uF,25V,20%  [CAPC2012X145N]
D3  LESD5D5.0CT1G  [LESD5D50CT1G]
D4  SK34A-LTP  [SK34ALTP]
D5  SK34A-LTP  [SK34ALTP]
FB2  600R@100MHz  [L0603]
IC4  TPS54202HDDCR  [SOT95P280X100-6N]
J3  GT-USB-7010ASV  [USB-C-SMD_G-SWITCH_GT-USB-7010ASV]
L1  2.5A,10uH,135mR,20%  [IND-SMD_L3.0-W3.0_FTC303020D]
R20  0603,5.1K,1%  [RESC1608X55N]
R21  0603,5.1K,1%  [RESC1608X55N]  (value not drawn)
R22  0603,510K,1%  [RESC1608X55N]
R23  0603,100K,1%  [RESC1608X55N]
R24  1206,0R,1%  [RESC3116X65N]
R25  0603,22.1K,1%  [RESC1608X55N]

### Nets
+3V3: C23.2 C24.2 C25.2 L1.2 R23.2
DGND: R24.2
PGND: C18.1 C19.1 C21.1 C22.1 C24.1 C25.1 D3.1 IC4.1(GND) J3.1(SHELL) J3.2(SHELL) J3.3(SHELL) J3.4(SHELL) J3.A1B12(GND) J3.B1A12(GND) R20.1 R21.1 R24.1 R25.1
VBATT: D4.2(A)
VBUS_USB: C19.2 D5.2(A) FB2.2
NetC18_2: C18.2 D3.2 FB2.1 J3.A4B9(VBUS) J3.B4A9(VBUS)
NetC20_1: C20.1 IC4.2(SW) L1.1
NetC20_2: C20.2 IC4.6(BOOT)
NetC21_2: C21.2 C22.2 D4.1(K) D5.1(K) IC4.3(VIN) R22.2
NetC23_1: C23.1 IC4.4(FB) R23.1 R25.2
NetIC4_5: IC4.5(EN) R22.1
NetJ3_A5: J3.A5(CC1) R20.2
NetJ3_B5: J3.B5(CC2) R21.2

Not connected (* = marked no-connect by the designer): J3 A6(DP1)* A7(DN1)* A8(SBU1)* B6(DP2)* B7(DN2)* B8(SBU2)*

### Library data of the parts
C18 = CC0603KRX7R9BB153: as C3 on sheet Motor Driver; Datasheet Link: https://componentsearchengine.com/Datasheets/2/CC0603KRX7R9BB104.pdf; Height: 0.9mm; Manufacturer_Part_Number: CC0603KRX7R9BB153; Mouser Part Number: 603-CC603KRX7R9BB104; Mouser Price/Stock: https://www.mouser.co.uk/ProductDetail/YAGEO/CC0603KRX7R9BB104?qs=vTakOoo5QyLvVCYM2ge8LQ%3D%3D; Arrow Part Number: CC0603KRX7R9BB104; Arrow Price/Stock: https://www.arrow.com/en/products/cc0603krx7r9bb104/yageo?utm_currency=USD&region=europe; LCSC Part #: C107076
C19 C20 C22 = CC0603KRX7R9BB104: as C4 on sheet Motor Driver; Datasheet Link: https://componentsearchengine.com/Datasheets/2/CC0603KRX7R9BB104.pdf; Height: 0.9mm; Manufacturer_Part_Number: CC0603KRX7R9BB104; Mouser Part Number: 603-CC603KRX7R9BB104; Mouser Price/Stock: https://www.mouser.co.uk/ProductDetail/YAGEO/CC0603KRX7R9BB104?qs=vTakOoo5QyLvVCYM2ge8LQ%3D%3D; Arrow Part Number: CC0603KRX7R9BB104; Arrow Price/Stock: https://www.arrow.com/en/products/cc0603krx7r9bb104/yageo?utm_currency=USD&region=europe; LCSC Part #: C14663
C21 = CC0805KKX5R8BB106: as C1 on sheet Motor Driver; Datasheet Link: https://www.yageo.com/upload/media/product/productsearch/datasheet/mlcc/UPY-GPHC_X5R_4V-to-50V_27.pdf; Height: 1.45mm; Manufacturer_Part_Number: CC0805KKX5R8BB106; Mouser Part Number: 603-CC805KKX5R8BB106; Mouser Price/Stock: https://www.mouser.co.uk/ProductDetail/YAGEO/CC0805KKX5R8BB106?qs=57cj7OiSijm89pM64t1AGQ%3D%3D; Arrow Part Number: CC0805KKX5R8BB106; Arrow Price/Stock: https://www.arrow.com/en/products/cc0805kkx5r8bb106/yageo?utm_currency=USD&region=nac; LCSC Part #: C89831
C23 = CC0603JRNPO9BN560: 50V 56pF NP0 ±5% 0603 Ceramic Capacitors RoHS; Manufacturer_Name: YAGEO; Datasheet Link: https://www.yageo.com/upload/media/product/app/datasheet/mlcc/upy-gphc_x7r_6_3v-to-250v.pdf; Height: 0.95mm; Manufacturer_Part_Number: CC0603JRNPO9BN560; Mouser Part Number: 603-CC603KRX7R9BB105; Mouser Price/Stock: https://www.mouser.co.uk/ProductDetail/YAGEO/CC0603KRX7R9BB105?qs=6wERJjOp3mmF17%252BYi8cgJQ%3D%3D; Arrow Part Number: CC0603KRX7R9BB105; Arrow Price/Stock: https://www.arrow.com/en/products/cc0603krx7r9bb105/yageo?utm_currency=USD&region=nac; LCSC Part #: C107053
C24 C25 = CC0805MKX5R8BB226: 25V 22uF X5R ±20% 0805 Ceramic Capacitors RoHS; Manufacturer_Name: YAGEO; Datasheet Link: https://www.yageo.com/upload/media/product/productsearch/datasheet/mlcc/UPY-GPHC_X5R_4V-to-50V_27.pdf; Height: 1.45mm; Manufacturer_Part_Number: CC0805MKX5R8BB226; Mouser Part Number: 603-CC805KKX5R8BB106; Mouser Price/Stock: https://www.mouser.co.uk/ProductDetail/YAGEO/CC0805KKX5R8BB106?qs=57cj7OiSijm89pM64t1AGQ%3D%3D; Arrow Part Number: CC0805KKX5R8BB106; Arrow Price/Stock: https://www.arrow.com/en/products/cc0805kkx5r8bb106/yageo?utm_currency=USD&region=nac; LCSC Part #: C784585
D3 = LESD5D5.0CT1G: 9.4A 18.6V 5.6V Bidirectional 5V SOD-523 ESD and Surge Protection (TVS/ESD) ROHS; Manufacturer_Name: LRC; Height: 0.7mm; Manufacturer_Part_Number: LESD5D5.0CT1G; LCSC Part #: C383211
D4 D5 = SK34A-LTP: 80A 40V 500mV@3A 3A SMA(DO-214AC) Single Diodes RoHS; Manufacturer_Name: MCC; Datasheet Link: https://mccsemi.com/pdf/Products/SK32A-L-SK310A-L(DO-214AC).pdf; Height: 2.44mm; Manufacturer_Part_Number: SK34A-LTP; Mouser Part Number: 833-SK34A-LTP; Mouser Price/Stock: https://www.mouser.co.uk/ProductDetail/Micro-Commercial-Components-MCC/SK34A-LTP?qs=JeAkOuORR2VPwzg48d%252BVAA%3D%3D; Arrow Part Number: SK34A-LTP; Arrow Price/Stock: https://www.arrow.com/en/products/sk34a-ltp/micro-commercial-components?utm_currency=USD&region=nac; Manu Part #: SK34A-LTP; LCSC Part #: C85269
FB2 = BLM18AG601SN1D: as FB1 on sheet STM32G4; LCSC Part #: C19330
IC4 = TPS54202HDDCR: 500kHz 2A Buck Adjustable 596mV~28V 1 TSOT-23-6 Voltage Regulators - DC DC Switching Regulators RoHS; Manufacturer_Name: Texas Instruments; Datasheet Link: http://www.ti.com/lit/gpn/tps54202h; Height: 1.1mm; Manufacturer_Part_Number: TPS54202HDDCR; Mouser Part Number: 595-TPS54202HDDCR; Mouser Price/Stock: https://www.mouser.co.uk/ProductDetail/Texas-Instruments/TPS54202HDDCR?qs=uP22XH7NdCtzy%252BOdxI8qhQ%3D%3D; Arrow Part Number: TPS54202HDDCR; Arrow Price/Stock: https://www.arrow.com/en/products/tps54202hddcr/texas-instruments?utm_currency=USD&region=europe; Manu Part #: TPS54202HDDCR; LCSC Part #: C527684
J3 = GT-USB-7010ASV: USB 2.0 3A 1 Surface Mount, Right Angle 16P Female -40℃~+85℃ Type-C SMD USB Connectors ROHS; LCSC Part #: C2988369; Manu Part #: GT-USB-7010ASV
L1 = FTC303020D100MBCA: 2.5A 10uH ±20% 3.8A 135mΩ SMD,3x3mm Fixed Inductors RoHS; Manu Part #: FTC303020D100MBCA; LCSC Part #: C7423323
R20 R21 = RC0603FR-075K1L: 100mW 5.1kΩ 75V ±100ppm/℃ Thick Film Resistor ±1% 0603 Chip Resistor - Surface Mount RoHS; Manufacturer_Name: YAGEO; Datasheet Link: https://www.mouser.com/catalog/specsheets/YAGEO_PYu_RC_Group_51_RoHS_L_12.pdf; Height: 0.55mm; Manufacturer_Part_Number: RC0603FR-075K1L; LCSC Part #: C105580
R22 = RC0603FR-07510KL: 100mW 510kΩ 75V ±100ppm/℃ Thick Film Resistor ±1% 0603 Chip Resistor - Surface Mount RoHS; Manufacturer_Name: YAGEO; Datasheet Link: https://www.mouser.com/catalog/specsheets/YAGEO_PYu_RC_Group_51_RoHS_L_12.pdf; Height: 0.55mm; Manufacturer_Part_Number: RC0603FR-07510KL; LCSC Part #: C114066; Manu Part #: RC0603FR-07510KL
R23 = RC0603FR-07100KL: as R10 on sheet STM32G4; Datasheet Link: https://www.mouser.com/catalog/specsheets/YAGEO_PYu_RC_Group_51_RoHS_L_12.pdf; Height: 0.55mm; Manufacturer_Part_Number: RC0603FR-07100KL; LCSC Part #: C14675
R24 = RC1206FR-070RL: 0Ω 250mW 200V Thick Film Resistor ±1% 1206 Chip Resistor - Surface Mount RoHS; Manufacturer_Name: YAGEO; Datasheet Link: https://www.yageogroup.com/content/datasheet/asset/file/PYU-RC_GROUP_51_ROHS_L; Height: 0.65mm; Manufacturer_Part_Number: RC1206FR-070RL; Mouser Part Number: 603-RC1206FR-070RL; Mouser Price/Stock: https://www.mouser.co.uk/ProductDetail/YAGEO/RC1206FR-070RL?qs=%2FbpERZPLKKvgeF8VBtNQLg%3D%3D; Arrow Part Number: RC1206FR-070RL; Arrow Price/Stock: https://www.arrow.com/en/products/rc1206fr-070rl/yageo?region=nac; Manu Part #: RC1206FR-070RL; LCSC Part #: C137394
R25 = RC0603FR-0722K1L: 22.1kΩ 100mW 75V ±100ppm/℃ Thick Film Resistor ±1% 0603 Chip Resistor - Surface Mount RoHS; Manufacturer_Name: YAGEO; Datasheet Link: https://www.mouser.com/catalog/specsheets/YAGEO_PYu_RC_Group_51_RoHS_L_12.pdf; Height: 0.55mm; Manufacturer_Part_Number: RC0603FR-0722K1L; LCSC Part #: C137768

## Nets that join several sheets
+3V3: Motor Driver (C4.2 IC2.1), STM32G4 (13 pins), Buck (5 pins)
DGND: Top Level (J2.3), Motor Driver (C3.1 C4.1 IC2.3 R2.1), U_Motor Driver/U_Motor Phase (C6_3.1 R6_3.1), U_Motor Driver/U_Motor Phase (C6_2.1 R6_2.1), U_Motor Driver/U_Motor Phase (C6_1.1 R6_1.1), STM32G4 (19 pins), Buck (R24.2)
PGND: Motor Driver (C1.2 C2.2 IC1.8), U_Motor Driver/U_Motor Phase (R7_3.1), U_Motor Driver/U_Motor Phase (R7_2.1), U_Motor Driver/U_Motor Phase (R7_1.1), Buck (18 pins)
VBATT: Motor Driver (C1.1 C2.1 IC1.7 R1.2), U_Motor Driver/U_Motor Phase (Q1_3.5 Q1_3.6 Q1_3.7 Q1_3.8), U_Motor Driver/U_Motor Phase (Q1_2.5 Q1_2.6 Q1_2.7 Q1_2.8), U_Motor Driver/U_Motor Phase (Q1_1.5 Q1_1.6 Q1_1.7 Q1_1.8), Buck (D4.2)
ADC1_IN1: U_Motor Driver/U_Motor Phase (C6_3.2 R4_3.1 R6_3.2), STM32G4 (IC3.8)
ADC1_IN2: U_Motor Driver/U_Motor Phase (C6_2.2 R4_2.1 R6_2.2), STM32G4 (IC3.9)
ADC1_IN5: U_Motor Driver/U_Motor Phase (C6_1.2 R4_1.1 R6_1.2), STM32G4 (IC3.28)
ADC1_IN10: Motor Driver (C3.2 R1.1 R2.2), STM32G4 (IC3.5)
ADC1_IN11: Motor Driver (IC2.2), STM32G4 (IC3.26)
NetC5_1_1: Motor Driver (IC1.12), U_Motor Driver/U_Motor Phase (9 pins)
NetC5_1_2: Motor Driver (IC1.14), U_Motor Driver/U_Motor Phase (C5_1.2)
NetC5_2_1: Motor Driver (IC1.15), U_Motor Driver/U_Motor Phase (9 pins)
NetC5_2_2: Motor Driver (IC1.17), U_Motor Driver/U_Motor Phase (C5_2.2)
NetC5_3_1: Motor Driver (IC1.18), U_Motor Driver/U_Motor Phase (9 pins)
NetC5_3_2: Motor Driver (IC1.20), U_Motor Driver/U_Motor Phase (C5_3.2)
NetIC1_9: Motor Driver (IC1.9), U_Motor Driver/U_Motor Phase (R5_1.1)
NetIC1_10: Motor Driver (IC1.10), U_Motor Driver/U_Motor Phase (R5_2.1)
NetIC1_11: Motor Driver (IC1.11), U_Motor Driver/U_Motor Phase (R5_3.1)
NetIC1_13: Motor Driver (IC1.13), U_Motor Driver/U_Motor Phase (R3_1.1)
NetIC1_16: Motor Driver (IC1.16), U_Motor Driver/U_Motor Phase (R3_2.1)
NetIC1_19: Motor Driver (IC1.19), U_Motor Driver/U_Motor Phase (R3_3.1)
OPAMP1_VINP: U_Motor Driver/U_Motor Phase (Q2_3.1 Q2_3.2 Q2_3.3 R7_3.2), STM32G4 (IC3.15)
OPAMP2_VINP: U_Motor Driver/U_Motor Phase (Q2_2.1 Q2_2.2 Q2_2.3 R7_2.2), STM32G4 (IC3.16)
OPAMP3_VINP: U_Motor Driver/U_Motor Phase (Q2_1.1 Q2_1.2 Q2_1.3 R7_1.2), STM32G4 (IC3.27)
TIM1_CH1: Motor Driver (IC1.1), STM32G4 (IC3.30)
TIM1_CH1N: Motor Driver (IC1.4), STM32G4 (IC3.2)
TIM1_CH2: Motor Driver (IC1.2), STM32G4 (IC3.31)
TIM1_CH2N: Motor Driver (IC1.5), STM32G4 (IC3.34)
TIM1_CH3: Motor Driver (IC1.3), STM32G4 (IC3.32)
TIM1_CH3N: Motor Driver (IC1.6), STM32G4 (IC3.46)
USART3_RX: Top Level (J2.1), STM32G4 (IC3.25)
USART3_TX: Top Level (J2.2), STM32G4 (IC3.22)